# Altium schematic sheet USBPROG_USBUART.SchDoc
size A3
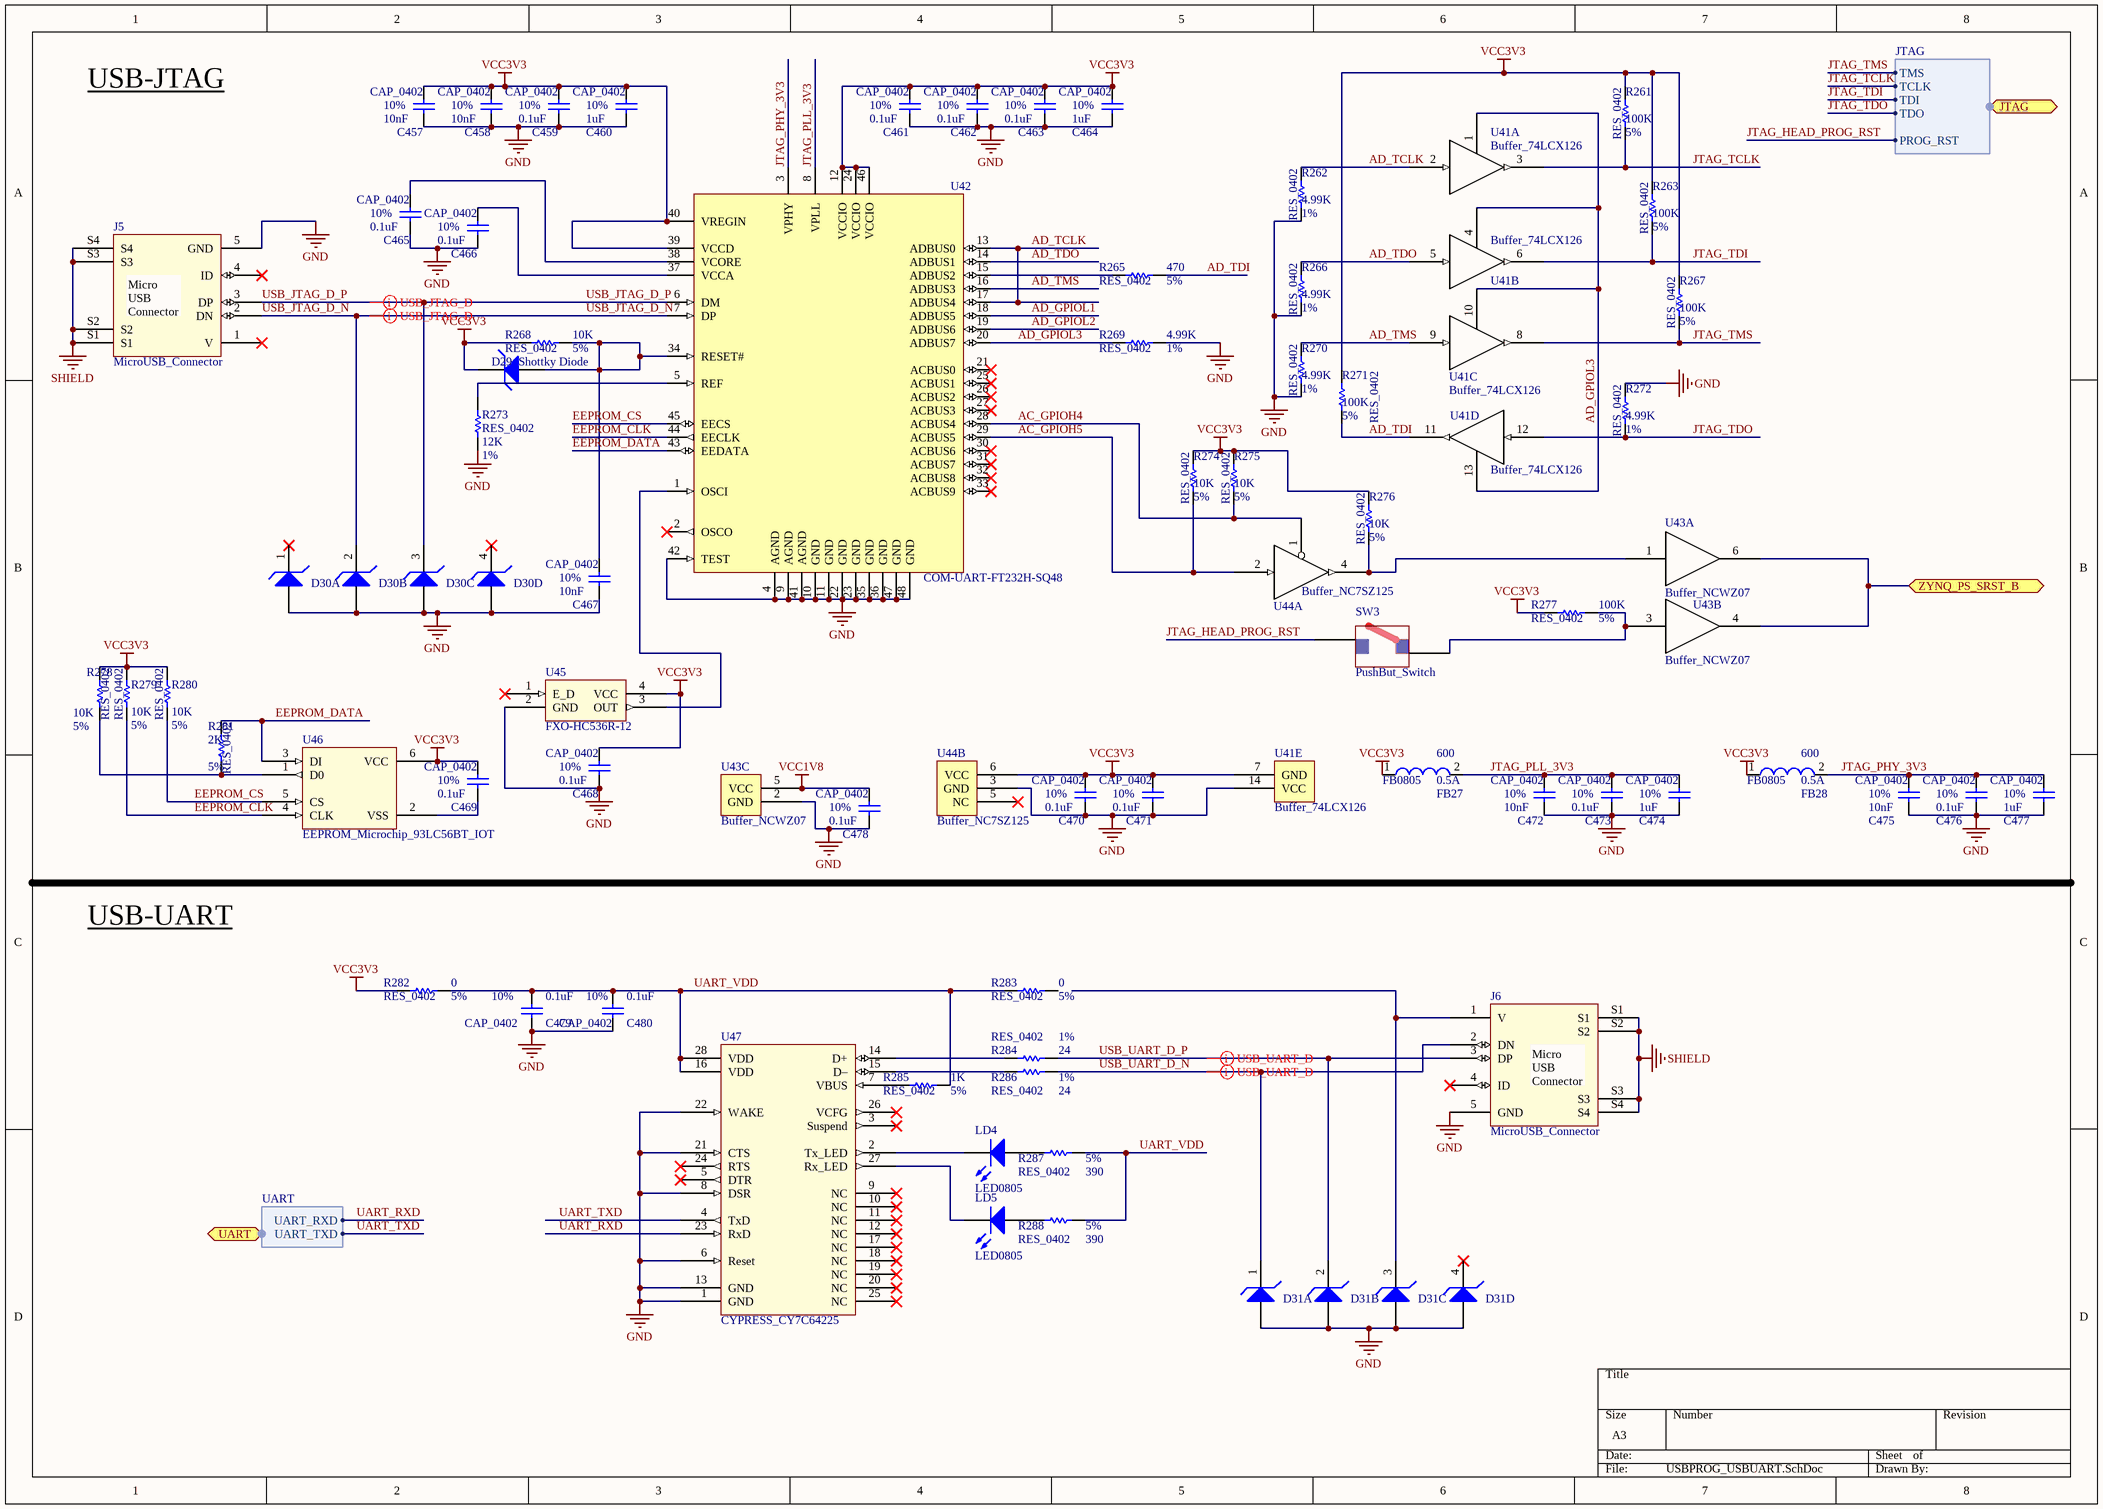
[diagram p0: USBPROG_USBUART.SchDoc]

## Parts
C457  CAP_0402  value 10nF  Tolerance: 10%  [CAPC0402(1005)60_N]
C458  CAP_0402  value 10nF  Tolerance: 10%  [CAPC0402(1005)60_N]
C459  CAP_0402  value 0.1uF  Tolerance: 10%  [CAPC0402(1005)60_N]
C460  CAP_0402  value 1uF  Tolerance: 10%  [CAPC0402(1005)60_N]
C461  CAP_0402  value 0.1uF  Tolerance: 10%  [CAPC0402(1005)60_N]
C462  CAP_0402  value 0.1uF  Tolerance: 10%  [CAPC0402(1005)60_N]
C463  CAP_0402  value 0.1uF  Tolerance: 10%  [CAPC0402(1005)60_N]
C464  CAP_0402  value 1uF  Tolerance: 10%  [CAPC0402(1005)60_N]
C465  CAP_0402  value 0.1uF  Tolerance: 10%  [CAPC0402(1005)60_N]
C466  CAP_0402  value 0.1uF  Tolerance: 10%  [CAPC0402(1005)60_N]
C467  CAP_0402  value 10nF  Tolerance: 10%  [CAPC0402(1005)60_N]
C468  CAP_0402  value 0.1uF  Tolerance: 10%  [CAPC0402(1005)60_N]
C469  CAP_0402  value 0.1uF  Tolerance: 10%  [CAPC0402(1005)60_N]
C470  CAP_0402  value 0.1uF  Tolerance: 10%  [CAPC0402(1005)60_N]
C471  CAP_0402  value 0.1uF  Tolerance: 10%  [CAPC0402(1005)60_N]
C472  CAP_0402  value 10nF  Tolerance: 10%  [CAPC0402(1005)60_N]
C473  CAP_0402  value 0.1uF  Tolerance: 10%  [CAPC0402(1005)60_N]
C474  CAP_0402  value 1uF  Tolerance: 10%  [CAPC0402(1005)60_N]
C475  CAP_0402  value 10nF  Tolerance: 10%  [CAPC0402(1005)60_N]
C476  CAP_0402  value 0.1uF  Tolerance: 10%  [CAPC0402(1005)60_N]
C477  CAP_0402  value 1uF  Tolerance: 10%  [CAPC0402(1005)60_N]
C478  CAP_0402  value 0.1uF  Tolerance: 10%  [CAPC0402(1005)60_N]
C479  CAP_0402  value 0.1uF  Tolerance: 10%  [CAPC0402(1005)60_N]
C480  CAP_0402  value 0.1uF  Tolerance: 10%  [CAPC0402(1005)60_N]
D29  Shottky Diode  [SchottkyDiode_RB751S40_2-PIN]
D30  QuadESDDiode_TEConnectivity_SESD0802Q4UG  [QuadESDDiode_TEConnectivity_SESD0802Q4UG_5-PIN]  (value not drawn)  (parts A,B,C,D of 4)
D31  QuadESDDiode_TEConnectivity_SESD0802Q4UG  [QuadESDDiode_TEConnectivity_SESD0802Q4UG_5-PIN]  (value not drawn)  (parts A,B,C,D of 4)
FB27  FB0805  Resistance: 600  Max_Current: 0.5A  [Inductor0805(2012)]
FB28  FB0805  Resistance: 600  Max_Current: 0.5A  [Inductor0805(2012)]
J5  MicroUSB_Connector
J6  MicroUSB_Connector
LD4  LED0805  [LED0603(1608)]
LD5  LED0805  [LED0603(1608)]
R261  RES_0402  value 100K  Tolerance: 5%  [RESC0402(1005)_N]
R262  RES_0402  value 4.99K  Tolerance: 1%  [RESC0402(1005)_N]
R263  RES_0402  value 100K  Tolerance: 5%  [RESC0402(1005)_N]
R265  RES_0402  value 470  Tolerance: 5%  [RESC0402(1005)_N]
R266  RES_0402  value 4.99K  Tolerance: 1%  [RESC0402(1005)_N]
R267  RES_0402  value 100K  Tolerance: 5%  [RESC0402(1005)_N]
R268  RES_0402  value 10K  Tolerance: 5%  [RESC0402(1005)_N]
R269  RES_0402  value 4.99K  Tolerance: 1%  [RESC0402(1005)_N]
R270  RES_0402  value 4.99K  Tolerance: 1%  [RESC0402(1005)_N]
R271  RES_0402  value 100K  Tolerance: 5%  [RESC0402(1005)_N]
R272  RES_0402  value 4.99K  Tolerance: 1%  [RESC0402(1005)_N]
R273  RES_0402  value 12K  Tolerance: 1%  [RESC0402(1005)_N]
R274  RES_0402  value 10K  Tolerance: 5%  [RESC0402(1005)_N]
R275  RES_0402  value 10K  Tolerance: 5%  [RESC0402(1005)_N]
R276  RES_0402  value 10K  Tolerance: 5%  [RESC0402(1005)_N]
R277  RES_0402  value 100K  Tolerance: 5%  [RESC0402(1005)_N]
R278  RES_0402  value 10K  Tolerance: 5%  [RESC0402(1005)_N]
R279  RES_0402  value 10K  Tolerance: 5%  [RESC0402(1005)_N]
R280  RES_0402  value 10K  Tolerance: 5%  [RESC0402(1005)_N]
R281  RES_0402  value 2K  Tolerance: 5%  [RESC0402(1005)_N]
R282  RES_0402  value 0  Tolerance: 5%  [RESC0402(1005)_N]
R283  RES_0402  value 0  Tolerance: 5%  [RESC0402(1005)_N]
R284  RES_0402  value 24  Tolerance: 1%  [RESC0402(1005)_N]
R285  RES_0402  value 1K  Tolerance: 5%  [RESC0402(1005)_N]
R286  RES_0402  value 24  Tolerance: 1%  [RESC0402(1005)_N]
R287  RES_0402  value 390  Tolerance: 5%  [RESC0402(1005)_N]
R288  RES_0402  value 390  Tolerance: 5%  [RESC0402(1005)_N]
SW3  PushBut_Switch  [PushButtonSwitch_CnK_1.14002.1110000]
U41  Buffer_74LCX126  [Buffer_Fairchild_74LCX126_DQFN-14]  (parts A,B,C,D,E of 5)
U42  COM-UART-FT232H-SQ48  [USB_COM_FTDI_FT232HQTRAY_QFN48_N]
U43  Buffer_NCWZ07  [Buffer_Fairchild_NCWZ07_SC70-6]  (parts A,B,C of 3)
U44  Buffer_NC7SZ125  [Buffer_Fairchild_NC7SZ125_SOT95P280X145-5N]  (parts A,B of 2)
U45  FXO-HC536R-12  [Oscillator_Fox_767-12-69_HC5]
U46  EEPROM_Microchip_93LC56BT_IOT  [EEPROM_Microchip_93LC56BT_IOT_SOT23-6]
U47  CYPRESS_CY7C64225  [Cypress_USB_UART_CY7C64225_SSSOP28]

## Ports
JTAG (harness JTAG), UART (harness UART), ZYNQ_PS_SRST_B (bidir)

## Harnesses
JTAG: TMS, TCLK, TDI, TDO, PROG_RST
UART: UART_TXD, UART_RXD

## Nets
GND: C457.1 C458.1 C459.1 C460.1 C461.1 C462.1 C463.1 C464.1 C465.1 C466.1 C467.1 C468.1 C470.1 C471.1 C472.1 C473.1 C474.1 C475.1 C476.1 C477.1 C478.1 C479.2 C480.2 D30.G(A) D31.G(A) J5.5(GND) J6.5(GND) R262.1 R266.1 R269.2 R270.1 R272.2 R273.1 U41.14(VCC) U42.4(AGND) U42.9(AGND) U42.10(GND) U42.11(GND) U42.22(GND) U42.23(GND) U42.35(GND) U42.36(GND) U42.41(AGND) U42.42(TEST) U42.47(GND) U42.48(GND) U43.2(GND) U44.3(GND) U45.2(GND) U47.1(GND) U47.6(Reset) U47.8(DSR) U47.13(GND) U47.21(CTS) U47.22(WAKE)
SHIELD: J5.S1 J5.S2 J5.S3 J5.S4 J6.S1 J6.S2 J6.S3 J6.S4
VCC1V8: C478.2 U43.5(VCC)
VCC3V3: C457.2 C458.2 C459.2 C460.2 C461.2 C462.2 C463.2 C464.2 C468.2 C469.2 C470.2 C471.2 D29.1(K) FB27.1 FB28.1 R261.2 R263.2 R267.2 R268.1 R271.2 R274.2 R275.2 R276.2 R277.2 R278.2 R279.2 R280.2 R282.1 U41.7(GND) U42.12(VCCIO) U42.24(VCCIO) U42.39(VCCD) U42.40(VREGIN) U42.46(VCCIO) U44.6(VCC) U45.4(VCC) U46.6(VCC)
AC_GPIOH4: R275.1 U42.28(ACBUS4) U44.1
AC_GPIOH5: R274.1 U42.29(ACBUS5) U44.2
AD_GPIOL1: U42.18(ADBUS5)
AD_GPIOL2: U42.19(ADBUS6)
AD_GPIOL3: R269.1 U41.1 U41.4 U41.10 U41.13 U42.20(ADBUS7)
AD_TCLK: R262.2 U41.2 U42.13(ADBUS0) U42.17(ADBUS4)
AD_TDI: R265.2 R271.1 U41.11
AD_TDO: R266.2 U41.5 U42.14(ADBUS1)
AD_TMS: R270.2 U41.9 U42.16(ADBUS3)
EEPROM_CLK: R279.1 U42.44(EECLK) U46.4(CLK)
EEPROM_CS: R280.1 U42.45(EECS) U46.5(CS)
EEPROM_DATA: R281.2 U42.43(EEDATA) U46.3(DI)
JTAG_HEAD_PROG_RST: SW3.3 ; port JTAG.PROG_RST
JTAG_PHY_3V3: C475.2 C476.2 C477.2 FB28.2 U42.3(VPHY)
JTAG_PLL_3V3: C472.2 C473.2 C474.2 FB27.2 U42.8(VPLL)
JTAG_TCLK: R261.1 U41.3 ; port JTAG.TCLK
JTAG_TDI: R263.1 U41.6 ; port JTAG.TDI
JTAG_TDO: R272.1 U41.12 ; port JTAG.TDO
JTAG_TMS: R267.1 U41.8 ; port JTAG.TMS
UART_RXD: U47.23(RxD) ; port UART.UART_RXD
UART_TXD: U47.4(TxD) ; port UART.UART_TXD
UART_VDD: C479.1 C480.1 R282.2 R283.1 R285.2 R287.2 R288.2 U47.16(VDD) U47.28(VDD)
USB_JTAG_D_N: D30.2(K) J5.2(DN) U42.7(DP)
USB_JTAG_D_P: D30.3(K) J5.3(DP) U42.6(DM)
USB_UART_D_N: D31.1(K) J6.2(DN) R286.2
USB_UART_D_P: D31.2(K) J6.3(DP) R284.2
ZYNQ_PS_SRST_B: U43.4 U43.6 ; port ZYNQ_PS_SRST_B
NetC465_2: C465.2 U42.38(VCORE)
NetC466_2: C466.2 U42.37(VCCA)
NetC467_2: C467.2 D29.2(A) R268.2 U42.34(RESET#)
NetC469_1: C469.1 U46.2(VSS)
NetD31_3: D31.3(K) J6.1(V)
NetLD4_1: LD4.1(K) U47.2(Tx_LED)
NetLD4_2: LD4.2(A) R287.1
NetLD5_1: LD5.1(K) U47.27(Rx_LED)
NetLD5_2: LD5.2(A) R288.1
NetR265_1: R265.1 U42.15(ADBUS2)
NetR273_2: R273.2 U42.5(REF)
NetR276_1: R276.1 U43.1 U44.4
NetR277_1: R277.1 SW3.4 U43.3
NetR278_1: R278.1 R281.1 U46.1(D0)
NetR284_1: R284.1 U47.14(D+)
NetR285_1: R285.1 U47.7(VBUS)
NetR286_1: R286.1 U47.15(D–)
NetU42_1: U42.1(OSCI) U45.3(OUT)

Not connected (* = marked no-connect by the designer): D30 1(K)* 4(K)*; D31 4(K)*; J5 1(V)* 4(ID)*; J6 4(ID)*; R283 2; U42 2(OSCO)* 21(ACBUS0)* 25(ACBUS1)* 26(ACBUS2)* 27(ACBUS3)* 30(ACBUS6)* 31(ACBUS7)* 32(ACBUS8)* 33(ACBUS9)*; U44 5(NC)*; U45 1(E_D)*; U47 3(Suspend)* 5(DTR)* 9(NC)* 10(NC)* 11(NC)* 12(NC)* 17(NC)* 18(NC)* 19(NC)* 20(NC)* 24(RTS)* 25(NC)* 26(VCFG)*

## Layout directives
differential pair: USB_JTAG_D_N, USB_JTAG_D_P, USB_UART_D_N, USB_UART_D_P

## Notes on the sheet
- USB-JTAG
- USB-UART
- (in symbol MicroUSB_Connector) Micro USB / Connector

## Library data of the parts
C457 C458 C467 C472 C475 = CAP_0402: 10000pF, ceramic, 10% 6.3V X5R, 0402; Part Number: GRM155R60J103KA01D; Manufacturer: Murata Electronics North America; Footprint Ref: CAPC0402(1005)60_N; Library Ref: CAP_0402
C459 C461-C463 C465 C466 C468-C471 C473 C476 C478-C480 = CAP_0402: 0.1uf, ceramic, 10%, 6.3V, X5R, 0402; Part Number: C1005X5R0J104K; Manufacturer: TDK Corporation; Footprint Ref: CAPC0402(1005)60_N; Library Ref: CAP_0402
C460 C464 C474 C477 = CAP_0402: 1uF, ceramic, 10%, 6.3V, X5R, 0402; Part Number: C1005X5R0J105K; Manufacturer: TDK Corporation; Footprint Ref: CAPC0402(1005)60_N; Library Ref: CAP_0402
D29 = ShottkyDiode: RB751S40, 40V 30mA schottky, SOD523F; Manufacturer: FAIRCHILD SEMICONDUCTOR; Part Number: RB751S40; Footprint Ref: SchottkyDiode_RB751S40_2-PIN; Library Ref: ShottkyDiode
D30 D31 = RF2197-000: SESD0802Q4UG, Quad Diode Array for ESD protection; Part Number: RF2197-000; Manufacturer: TE Connectivity
FB27 FB28 = FerriteBead0805: MPZ2012S601A, 600 ohm, 100MHz, 0805; Manufacturer: TDK Corporation; Value: 600; Part Number: MPZ2012S601A; Footprint Ref: Inductor0805(2012); Library Ref: FerriteBead0805
LD4 LD5 = LED0805: LED 565NM GRN DIFF 0603 SMD; Part Number: SML-LX0603GW-TR; Manufacturer: Lumex Opto/Components Inc; Value: GREEN; Footprint Ref: LED0603(1608); Library Ref: LED0603
R261 R263 R267 R271 R277 = RES_0402: 100K ohm, 5%, 1/16W, 0402; Part Number: RC0402JR-07100KL; Manufacturer: Yageo America; Library Ref: RES_0402; Footprint Ref: RESC0402(1005)_N
R262 R266 R269 R270 R272 = RES_0402: 4.99K ohm, 1% 1/16W, 0402; Part Number: CRCW04024K99FKED; Manufacturer: Vishay/Dale; Library Ref: RES_0402; Footprint Ref: RESC0402(1005)_N
R265 = RES_0402: 470 ohm, 5%, 1/16W, 0402; Part Number: MCR01MZPJ471; Manufacturer: ROHM; Library Ref: RES_0402; Footprint Ref: RESC0402(1005)_N
R268 R274-R276 R278-R280 = RES_0402: 10K ohm, 5%, 1/16W, 0402; Part Number: RC0402JR-0710KL; Manufacturer: Yageo America; Library Ref: RES_0402; Footprint Ref: RESC0402(1005)_N
R273 = RES_0402: 12K ohm, 1% 1/10W, 0402; Part Number: ERJ-2RKF1202X; Manufacturer: Panasonic - ECG; Library Ref: RES_0402; Footprint Ref: RESC0402(1005)_N
R281 = RES_0402: 2K ohm, 5% 1/16W, 0402; Part Number: ERJ-2GEJ202X; Manufacturer: Panasonic - ECG; Library Ref: RES_0402; Footprint Ref: RESC0402(1005)_N
R282 R283 = RES_0805: 0.0 ohm shunt, 5%, 1/16W, 0402; Part Number: RC0402JR-070RL; Manufacturer: Yageo America; Library Ref: RES_0402; Footprint Ref: RESC0402(1005)_N
R284 R286 = RES_0402: 24 ohm, 1% 1/16W, 0402; Part Number: CRCW040224R0FKED; Manufacturer: Vishay/Dale; Library Ref: RES_0402; Footprint Ref: RESC0402(1005)_N
R285 = RES_0402: 1K ohm, 5%, 1/16W, 0402; Part Number: RC0402JR-071KL; Manufacturer: Yageo America; Library Ref: RES_0402; Footprint Ref: RESC0402(1005)_N
R287 R288 = RES_0402: 390 ohm, 5%, 1/16W, 0402; Part Number: RC0402JR-07390RL; Manufacturer: Yageo America; Library Ref: RES_0402; Footprint Ref: RESC0402(1005)_N
SW3 = 1.14002.1110000: SWITCH PUSH SPST-NO 0.1A 35V; Manufacturer: C&K Components; Part Number: 1.14002.1110000
U41 = Buffer_74LCX126: 74LCX126BQX, quad buffer, LV N-Inv, DQFN14; Manufacturer: FAIRCHILD SEMICONDUCTOR; Part Number: 74LCX126BQX; Footprint Ref: Buffer_Fairchild_74LCX126_DQFN-14; Library Ref: Buffer_Fairchild_74LCX126
U42 = COM-UART-FT232H-SQ48: FT232HQ, USB HS to UART/FIFO SPI/JTAG/I2C, QFN-48; Manufacturer: FTDI; Part Number: FT232HQ; Footprint Ref: USB_COM_FTDI_FT232HQTRAY_QFN48_N; Library Ref: COM_UART_FTDI_TRAY_FT232H-SQ48
U43 = NC7WZ07P6X: NC7WZ07, dual non-inverting buffer, SC-70-6 (SOT-363); Manufacturer: FAIRCHILD OPTOELECTRICS GROUP; Part Number: NC7WZ07P6X; Footprint Ref: Buffer_Fairchild_NCWZ07_SC70-6; Library Ref: Buffer_Fairchild_NCWZ07
U44 = Buffer_NC7SZ125: NC7SZ125M5X, Tri-State Buffer UHS, SOT-23; Manufacturer: FAIRCHILD SEMICONDUCTOR; Part Number: NC7SZ125M5X; Footprint Ref: Buffer_Fairchild_NC7SZ125_SOT95P280X145-5N; Library Ref: Buffer_Fairchild_NC7SZ125
U45 = FXO-HC536R-12: 767-12-69, 12MHz 3.3V HCMOS Oscillator, HC5; Manufacturer: Fox Electronics; Part Number: FXO-HC536R-12
U46 = EEPROM_Microchip_93LC56BT_IOT: 93LC56BT-I/OT, EEPROM 2Kbit 3MHz, SOT23-6; Manufacturer: Microchip Technology; Part Number: 93LC56BT-I/OT; Footprint Ref: EEPROM_Microchip_93LC56BT_IOT_SOT23-6; Library Ref: EEPROM_Microchip_93LC56BT_IOT
U47 = CYPRESS_CY7C64225: CY7C64225-28PVXC, USB-UART bridge; Manufacturer: Cypress Semiconductor; Part Number: CY7C64225-28PVXC; Footprint Ref: Cypress_USB_UART_CY7C64225_SSSOP28; Library Ref: Cypress_USB_UART_CY7C64225